# EAGLE design 2x3Keyboard (EAGLE 8.2.0)
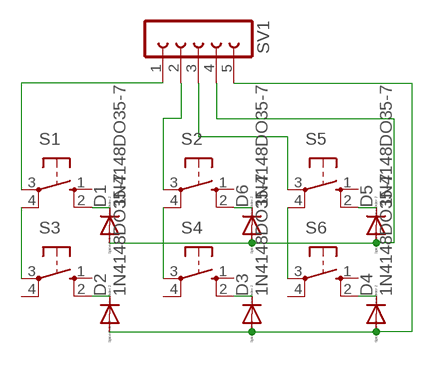
[diagram p0: schematic, sheet 1]

## Parts
D1  1N4148DO35-7  [DO35-7]
D2  1N4148DO35-7  [DO35-7]
D3  1N4148DO35-7  [DO35-7]
D4  1N4148DO35-7  [DO35-7]
D5  1N4148DO35-7  [DO35-7]
D6  1N4148DO35-7  [DO35-7]
S1  10-XX  [B3F-10XX]
S2  10-XX  [B3F-10XX]
S3  10-XX  [B3F-10XX]
S4  10-XX  [B3F-10XX]
S5  10-XX  [B3F-10XX]
S6  10-XX  [B3F-10XX]
SV1  FE05-1  [FE05-1]

## Nets
N$1: S1.3(P) SV1.1
N$2: S1.4(P1) S3.3(P)
N$3: S2.4(P1) S4.3(P)
N$4: S5.4(P1) S6.3(P)
N$5: S2.3(P) SV1.2
N$6: S5.3(P) SV1.3
N$7: D1.C S1.2(S1)
N$8: D6.C S2.2(S1)
N$9: D5.C S5.2(S1)
N$10: D4.C S6.2(S1)
N$11: D3.C S4.2(S1)
N$12: D2.C S3.2(S1)
N$13: D2.A D3.A D4.A SV1.5
N$14: D1.A D5.A D6.A SV1.4
Unconnected: S1.1(S) S2.1(S) S3.1(S) S3.4(P1) S4.1(S) S4.4(P1) S5.1(S) S6.1(S) S6.4(P1)

## Library data of the parts
D1-D6 = diode:1N4148: DIODE high speed (Philips)
S1-S6 = switch-omron:10-XX: OMRON SWITCH; MPN: B3F-1000; OC_FARNELL: 176432; OC_NEWARK: 36M3542
SV1 = con-lsta:FE05-1: FEMALE HEADER; OC_FARNELL: unknown; OC_NEWARK: unknown

## Board
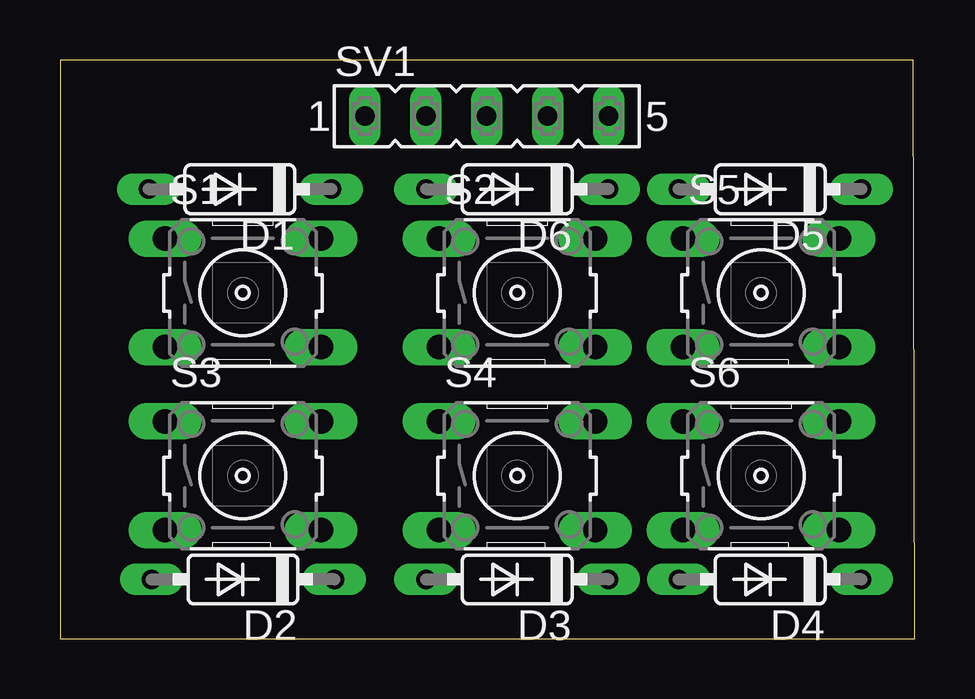
[diagram p1: board, top side]
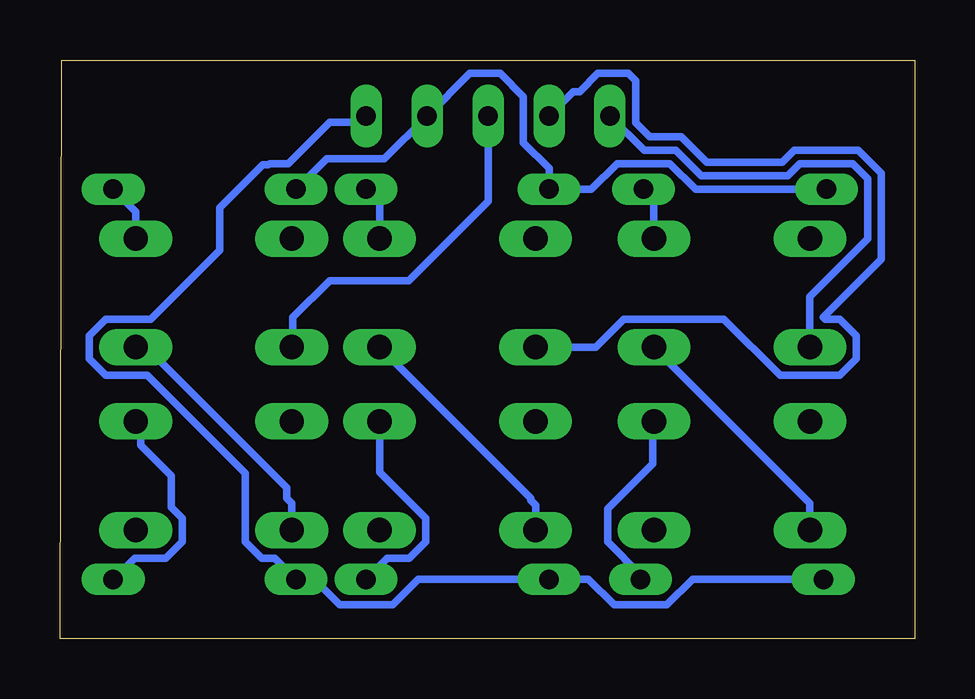
[diagram p2: board, bottom side, seen from below]

Size 35.62 x 24.1 mm. Coordinates in mm from the lower left corner, seen from the top.
Outline: 0,0 35.62,0 35.55,24.1 0,24.1 0,0
Copper layers (1*16): Top 0.035mm / dielectric 1.5mm / Bottom 0.035mm
Design rules "default *": minimum track width 10mil, minimum drill 0.35mm, track to track 10mil, track to pad 10mil, pad to pad 10mil, via to via 10mil, smd to smd 10mil, copper to edge 40mil, drill to drill 40mil, minimum pad ring 10mil, minimum via ring 8mil, stop-mask expansion 4mil, vias tented up to drill 0mil, thermal gap 10mil

### Footprints (pad centres in the part's own frame; a part is rotated, then mirrored left to right if it is on the bottom)
DO35-7 = drill 0.813 long: A 3.81,0; C -3.81,0
B3F-10XX = drill 1.016 long: 1 -3.251,2.261; 2 3.251,2.261; 3 -3.251,-2.261; 4 3.251,-2.261
FE05-1 = drill 0.813 long: 1 -5.08,0; 2 -2.54,0; 3 0,0; 4 2.54,0; 5 5.08,0

### Placement (x,y rotation side)
D1  7.49,18.72 180 top
D2  7.62,2.46 180 top
D3  19.05,2.46 180 top
D4  29.59,2.46 180 top
D5  29.59,18.72 180 top
D6  19.05,18.72 180 top
S1  7.62,14.4 0 top
S2  19.05,14.4 0 top
S3  7.62,6.78 0 top
S4  19.05,6.78 0 top
S5  29.21,14.4 0 top
S6  29.21,6.78 0 top
SV1  17.78,21.77 0 top

### Tracks (layer width: path | path; a pad name or v marks a point on that pad's centre or on a via)
N$1
  Bottom 0.305: S1.3 4.37,14.25 1.96,16.66 1.96,19.16 2.58,19.79 4.79,19.79 5.29,19.28 8.9,19.28 9.97,20.35 11.28,20.35 SV1.1
N$2
  Bottom 0.305: S3.3 4.37,5.64 S1.4
N$3
  Bottom 0.305: S4.3 15.8,5.56 16,5.77 16,5.84 S2.4
N$4
  Bottom 0.305: S6.3 25.96,5.64 26.16,5.84 26.16,6.27 32.03,12.14 S5.4
N$5
  Bottom 0.305: S2.3 13.29,12.14 12.12,13.31 7.95,13.31 5.61,10.97 3.12,10.97 2.44,11.66 2.44,12.62 3.12,13.31 3.73,13.31 3.81,13.39 1.4,15.8 1.4,19.39 2.35,20.35 5.02,20.35 5.52,19.84 8.67,19.84 9.74,20.9 11.05,20.9 11.63,21.49 11.63,23.24 11.94,23.55 13.21,23.55 13.97,22.78 14.22,22.78 SV1.2
N$6
  Bottom 0.305: SV1.3 17.78,18.21 21.08,14.91 24.38,14.91 25.91,13.39 25.91,12.19 S5.3
N$7
  Bottom 0.305: S1.2 10.87,18.29 D1.C
N$8
  Bottom 0.305: S2.2 22.3,18.16 D6.C
N$9
  Bottom 0.305: S5.2 32.46,17.78 D5.C
N$10
  Bottom 0.305: D4.C 32.51,3.35 31.22,3.35 30.53,4.04 30.53,5 30.99,5.46 30.99,6.78 32.26,8.05 32.26,8.84 S6.2
N$11
  Bottom 0.305: D3.C 21.97,3.35 21.05,3.35 20.37,4.04 20.37,5 22.3,6.94 S4.2
N$12
  Bottom 0.305: D2.C 11.43,2.67 12.8,4.04 12.8,5.41 10.92,7.29 10.92,8.99 S3.2
N$13
  Bottom 0.305: D2.A 9.26,2.46 10.33,1.4 12.53,1.4 13.6,2.46 D3.A 20.69,2.46 21.76,1.4 23.96,1.4 25.03,2.46 D4.A 26.67,3.35 27.21,3.35 27.89,4.04 27.89,6.88 31.98,10.97 33.71,10.97 34.39,11.66 34.39,12.62 33.71,13.31 31.83,13.31 28.96,16.18 28.96,17.96 27.18,19.74 26.93,19.74 26.88,19.79 26.11,19.79 24.38,21.51 23.11,21.51 SV1.5
N$14
  Bottom 0.305: D1.A 9.13,18.72 10.2,19.79 12.41,19.79 13.47,18.72 D6.A 15.24,19.6 16.31,20.67 16.31,22.58 17.27,23.55 18.54,23.55 SV1.4 22.1,19.99 24.51,19.99 D5.A